# Altium project v1.0.PrjPcb
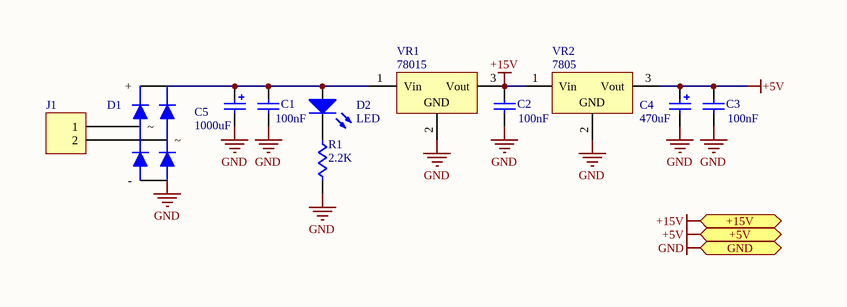
[diagram p0: Power Supply.SchDoc]
4 sheets, 28 parts. Net scope: flat (ports and power ports of the same name join across sheets).
Board file: PCB1.PcbDoc
Sheets:
  Power Supply.SchDoc
  Key_Reset.SchDoc
  Programer Connectors_SPI.SchDoc
  Converter_Voltage to Current_2.SchDoc

## Sheet Power Supply.SchDoc
size 157 x 55 mm

### Parts
C1  value 100nF  [CAPNTO2.54-3.05x1.78A]  (hidden comment: Cap)
C2  value 100nF  [CAPNTO2.54-3.05x1.78A]  (hidden comment: Cap)
C3  value 100nF  [CAPNTO2.54-3.05x1.78A]  (hidden comment: Cap)
C4  value 470uF  [CAPPR3.05-3.81x6.35]  (hidden comment: Cap Pol1)
C5  value 1000uF  [CAPPR5-10x12.5]  (hidden comment: Cap Pol1)
D1  Bridge_1  [KBP]  (value not drawn)
D2  LED  [LED-5mm_Red]
J1  Header 2  [Fonics_2PIN_1]  (value not drawn)
R1  value 2.2K  [AXIAL-0.4]  (hidden comment: Res1)
VR1  value 78015  [TO220V]  (hidden comment: Volt Reg)
VR2  value 7805  [TO220V]  (hidden comment: Volt Reg)

### Ports
+5V (out), +15V (out), GND (out)

### Nets
+5V: C3.2 C4.1 VR2.3(Vout) ; port +5V
+15V: C2.2 VR1.3(Vout) VR2.1(Vin) ; port +15V
GND: C1.1 C2.1 C3.1 C4.2 C5.2 D1.1(-) R1.2 VR1.2(GND) VR2.2(GND) ; port GND
NetC1_2: C1.2 C5.1 D1.3(+) D2.1(A) VR1.1(Vin)
NetD1_2: D1.2 J1.2
NetD1_4: D1.4 J1.1
NetD2_2: D2.2(K) R1.1

### Library data of the parts
C1-C3 = Cap: Capacitor; Manufacturer: Generic Components; Class I: Passive; Published: 8-Jun-2000; Revision: July-2002: Re-released for DXP Platform.; Publisher: Altium Limited; Class II: Capacitor
C4 C5 = Cap Pol1: Polarized Capacitor (Radial); Manufacturer: Generic Components; Class I: Passive; Published: 8-Jun-2000; Revision: July-2002: Re-released for DXP Platform.; Publisher: Altium Limited; Class II: Capacitor
D1 = Bridge_1: Full Wave Diode Bridge; Manufacturer: Generic Components; Class I: Discrete; Class II: Rectifier - Bridge; Published: 8-Jun-2000; Revision: July-2002: Re-released for DXP Platform.; Publisher: Altium Limited
D2 = LED: Typical INFRARED GaAs LED; Manufacturer: Generic Components; Class I: Optoelectronic; Published: 8-Jun-2000; Revision: July-2002: Re-released for DXP Platform.; Publisher: Altium Limited; Class II: LED
J1 = Header 2: Header, 2-Pin; LatestRevisionDate: 17-Jul-2002; LatestRevisionNote: Re-released for DXP Platform.; Publisher: Altium Limited
R1 = Res1: Resistor; Manufacturer: Generic Components; Class I: Passive; Published: 8-Jun-2000; Revision: July-2002: Re-released for DXP Platform.; Publisher: Altium Limited; Class II: Resistor
VR1 VR2 = Volt Reg: Voltage Regulator; Manufacturer: Generic Components; Class I: Power Management; Published: 24-Mar-1999; Revision: July-2002: Re-released for DXP Platform.; Publisher: Altium Limited; Class II: Voltage Regulator

## Sheet Key_Reset.SchDoc
size 63 x 63 mm
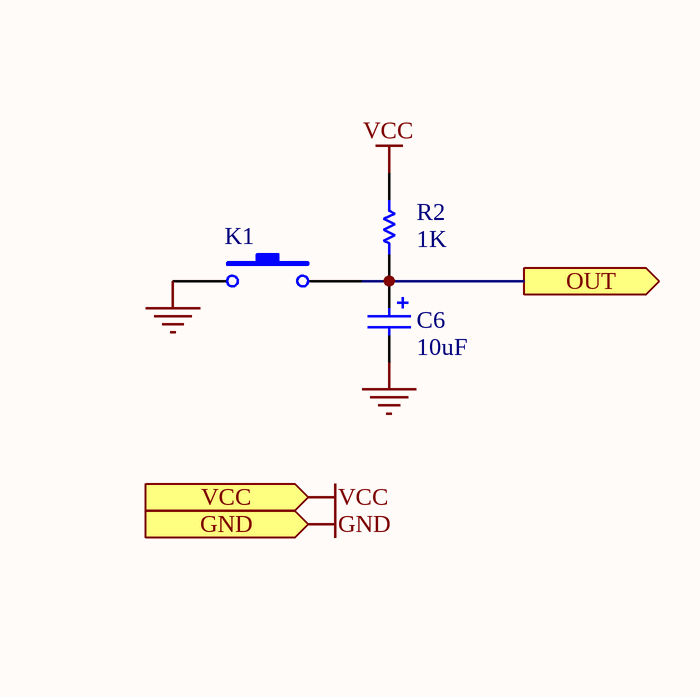
[diagram p1: Key_Reset.SchDoc]

### Parts
C6  value 10uF  [CAPPR2.5-6.3x5]  (hidden comment: Capacitor)
K1  SW-PB  [SPST-2_2]  (value not drawn)
R2  value 1K  [AXIAL-0.4]  (hidden comment: Res1)

### Ports
GND (in), OUT (out), VCC (in)

### Nets
GND: C6.2 K1.1 ; port GND
VCC: R2.1 ; port VCC
NetC6_1: C6.1 K1.2 R2.2 ; port OUT

### Library data of the parts
C6 = Cap Pol1: as C4 on sheet Power Supply; Published: 8-Jun-2000; Revision: July-2002: Re-released for DXP Platform.; Publisher: Altium Limited; Class II: Capacitor
K1 = SW-PB: Switch; Manufacturer: Generic Components; Published: 24-Mar-1999; Revision: July-2002: Re-released for DXP Platform.; Publisher: Altium Limited
R2 = Res1: as R1 on sheet Power Supply; Published: 8-Jun-2000; Revision: July-2002: Re-released for DXP Platform.; Publisher: Altium Limited; Class II: Resistor

## Sheet Programer Connectors_SPI.SchDoc
size 38 x 38 mm
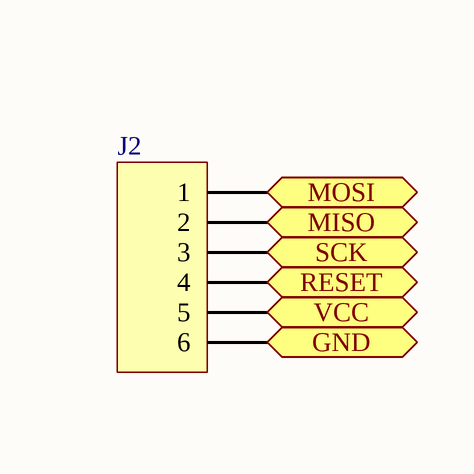
[diagram p2: Programer Connectors_SPI.SchDoc]

### Parts
J2  Header 6  [HDR1X6]  (value not drawn)

### Ports
GND (in), MISO (out), MOSI (out), RESET (out), SCK (out), VCC (in)

### Nets
GND: J2.6 ; port GND
VCC: J2.5 ; port VCC
NetJ2_1: J2.1 ; port MOSI
NetJ2_2: J2.2 ; port MISO
NetJ2_3: J2.3 ; port SCK
NetJ2_4: J2.4 ; port RESET

### Library data of the parts
J2 = Header 6: Header, 6-Pin; LatestRevisionDate: 17-Jul-2002; LatestRevisionNote: Re-released for DXP Platform.; Publisher: Altium Limited

## Sheet Converter_Voltage to Current_2.SchDoc
size 190 x 106 mm
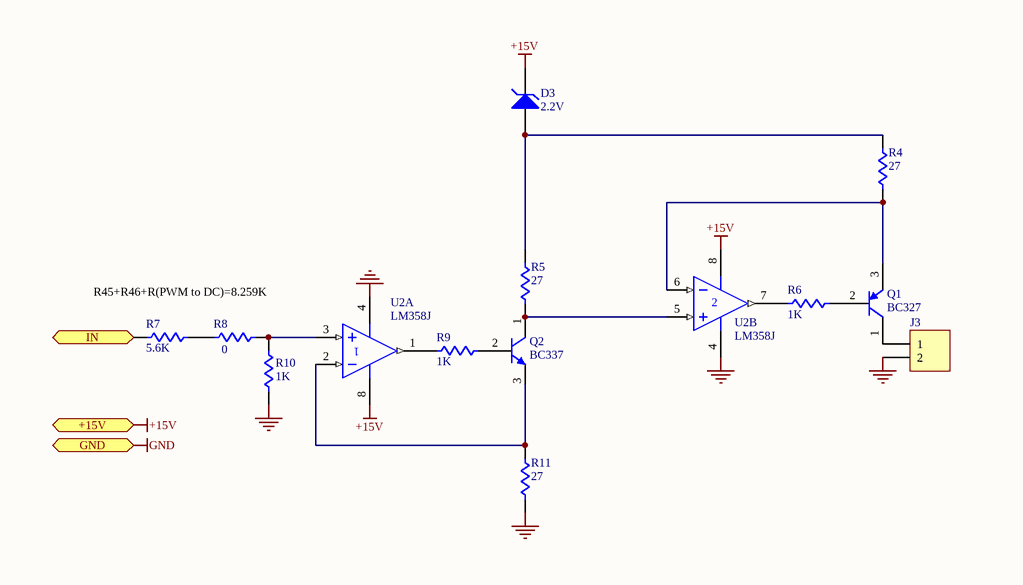
[diagram p3: Converter_Voltage to Current_2.SchDoc]

### Parts
D3  value 2.2V  [DIODE-0.4]  (hidden comment: D Zener)
J3  Header 2  [Fonics_2PIN_1]  (value not drawn)
Q1  Device: BC327  [TO92C]  (hidden comment: PNP)
Q2  value BC337  [TO92C]  (hidden comment: NPN)
R4  value 27  [AXIAL-0.4]  (hidden comment: Res1)
R5  value 27  [AXIAL-0.4]  (hidden comment: Res1)
R6  value 1K  [AXIAL-0.4]  (hidden comment: Res1)
R7  value 5.6K  [AXIAL-0.4]  (hidden comment: Res1)
R8  value 0  [AXIAL-0.4]  (hidden comment: Res1)
R9  value 1K  [AXIAL-0.4]  (hidden comment: Res1)
R10  value 1K  [AXIAL-0.4]  (hidden comment: Res1)
R11  value 27  [AXIAL-0.4]  (hidden comment: Res1)
U2  LM358J  [693-02]  (parts A,B of 2)

### Ports
+15V (in), GND (in), IN (in)

### Nets
+15V: D3.2(K) U2.8(V+) ; port +15V
GND: J3.2 R10.2 R11.1 U2.4(V-) ; port GND
NetD3_1: D3.1(A) R4.2 R5.2
NetJ3_1: J3.1 Q1.1(C)
NetQ1_2: Q1.2(B) R6.2
NetQ1_3: Q1.3(E) R4.1 U2.6(IN-)
NetQ2_1: Q2.1(C) R5.1 U2.5(IN+)
NetQ2_2: Q2.2(B) R9.2
NetQ2_3: Q2.3(E) R11.2 U2.2(IN-)
NetR6_1: R6.1 U2.7(OUT)
NetR7_1: R7.1 ; port IN
NetR7_2: R7.2 R8.1
NetR8_2: R8.2 R10.1 U2.3(IN+)
NetR9_1: R9.1 U2.1(OUT)

### Notes on the sheet
- R45+R46+R(PWM to DC)=8.259K

### Library data of the parts
D3 = D Zener: Zener Diode; Manufacturer: Generic Components; Class I: Discrete; Class II: Diode - Zener; Published: 8-Jun-2000; Revision: July-2002: Re-released for DXP Platform.; Publisher: Altium Limited
J3 = Header 2: Header, 2-Pin; LatestRevisionDate: 17-Jul-2002; LatestRevisionNote: Re-released for DXP Platform.; Publisher: Altium Limited
Q1 = PNP: Silicon Bipolar Transistor; Package Reference: TO-92A
Q2 = NPN: NPN Bipolar Transistor; Manufacturer: Generic Components; Class I: Discrete; Class II: BJT - Low Power; Published: 8-Jun-2000; Revision: July-2002: Re-released for DXP Platform.; Publisher: Altium Limited
R4-R11 = Res1: as R1 on sheet Power Supply; Published: 8-Jun-2000; Revision: July-2002: Re-released for DXP Platform.; Publisher: Altium Limited; Class II: Resistor
U2 = LM358J: Dual Low-Power Operational Amplifier; Published: 17-Jul-2002; LatestRevisionDate: 06-Jun-2005; LatestRevisionNote: Stylized 3D Model Added.; DatasheetVersion: 1988; PackageReference: 693-02; Publisher: Altium Limited; PackageDescription: DIP; 8 Leads; Row Spacing 7.62 mm; Pitch 2.54 mm; Code_JEDEC: MO-001-AN; ComponentLink1Description: Manufacturer Link; ComponentLink1URL: http://www.onsemi.com/site/products/parametrics/0,4446,251,00.html; ComponentLink2Description: Datasheet; ComponentLink2URL: http://www.onsemi.com/pub/Collateral/LM358-D.PDF

## Nets that join several sheets
+15V: Power Supply (C2.2 VR1.3 VR2.1), Converter_Voltage to Current_2 (D3.2 U2.8)
GND: Power Supply (9 pins), Key_Reset (C6.2 K1.1), Programer Connectors_SPI (J2.6), Converter_Voltage to Current_2 (J3.2 R10.2 R11.1 U2.4)
VCC: Key_Reset (R2.1), Programer Connectors_SPI (J2.5)